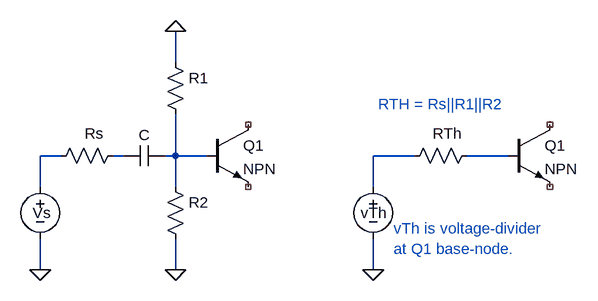
[diagram p0: schematic bjt_input_thevenin_VTh_RTh.asc]
bjt_input_thevenin_VTh_RTh.asc, the LTspice schematic file:
Version 4
SHEET 1 880 680
WIRE 160 32 160 -16
WIRE -16 176 -48 176
WIRE 80 176 64 176
WIRE 160 176 160 112
WIRE 160 176 144 176
WIRE 208 176 160 176
WIRE 528 176 464 176
WIRE 672 176 608 176
WIRE -48 224 -48 176
WIRE 160 224 160 176
WIRE 464 224 464 176
WIRE -48 352 -48 304
WIRE 160 352 160 304
WIRE 464 352 464 304
FLAG -48 352 0
FLAG 160 352 0
FLAG 160 -16 0
FLAG 464 352 0
SYMBOL npn 208 128 R0
SYMATTR InstName Q1
SYMBOL voltage -48 208 R0
WINDOW 0 -12 56 Left 2
SYMATTR InstName Vs
SYMATTR Value ""
SYMBOL res 144 16 R0
SYMATTR InstName R1
SYMATTR Value ""
SYMBOL res 144 208 R0
SYMATTR InstName R2
SYMATTR Value ""
SYMBOL res 80 160 R90
WINDOW 0 -3 45 VBottom 2
WINDOW 3 32 56 VTop 2
SYMATTR InstName Rs
SYMATTR Value ""
SYMBOL cap 144 160 R90
WINDOW 0 0 32 VBottom 2
WINDOW 3 32 32 VTop 2
SYMATTR InstName C
SYMATTR Value ""
SYMBOL voltage 464 208 R0
WINDOW 0 -19 56 Left 2
SYMATTR InstName vTh
SYMATTR Value ""
SYMBOL res 624 160 R90
WINDOW 0 -3 45 VBottom 2
WINDOW 3 32 56 VTop 2
SYMATTR InstName RTh
SYMATTR Value ""
SYMBOL npn 672 128 R0
SYMATTR InstName Q1
TEXT 472 96 Left 2 ;RTH = Rs||R1||R2
TEXT 496 288 Left 2 ;vTh is voltage-divider\nat Q1 base-node.

The netlist it stands for:
* bjt_input_thevenin_VTh_RTh.asc
Q1 NC_01 N003 NC_02 0 NPN
Vs N001 0
R1 0 N003
R2 N003 0
Rs N002 N001
C N003 N002
vTh N004 0
RTh N005 N004
Q1 NC_03 N005 NC_04 0 NPN
.model NPN NPN
.model PNP PNP
.lib standard.bjt
* RTH = Rs||R1||R2
* vTh is voltage-divider
* at Q1 base-node.
.backanno
.end